# Altium schematic sheet ChargeControlBoard.SchDoc
size A3
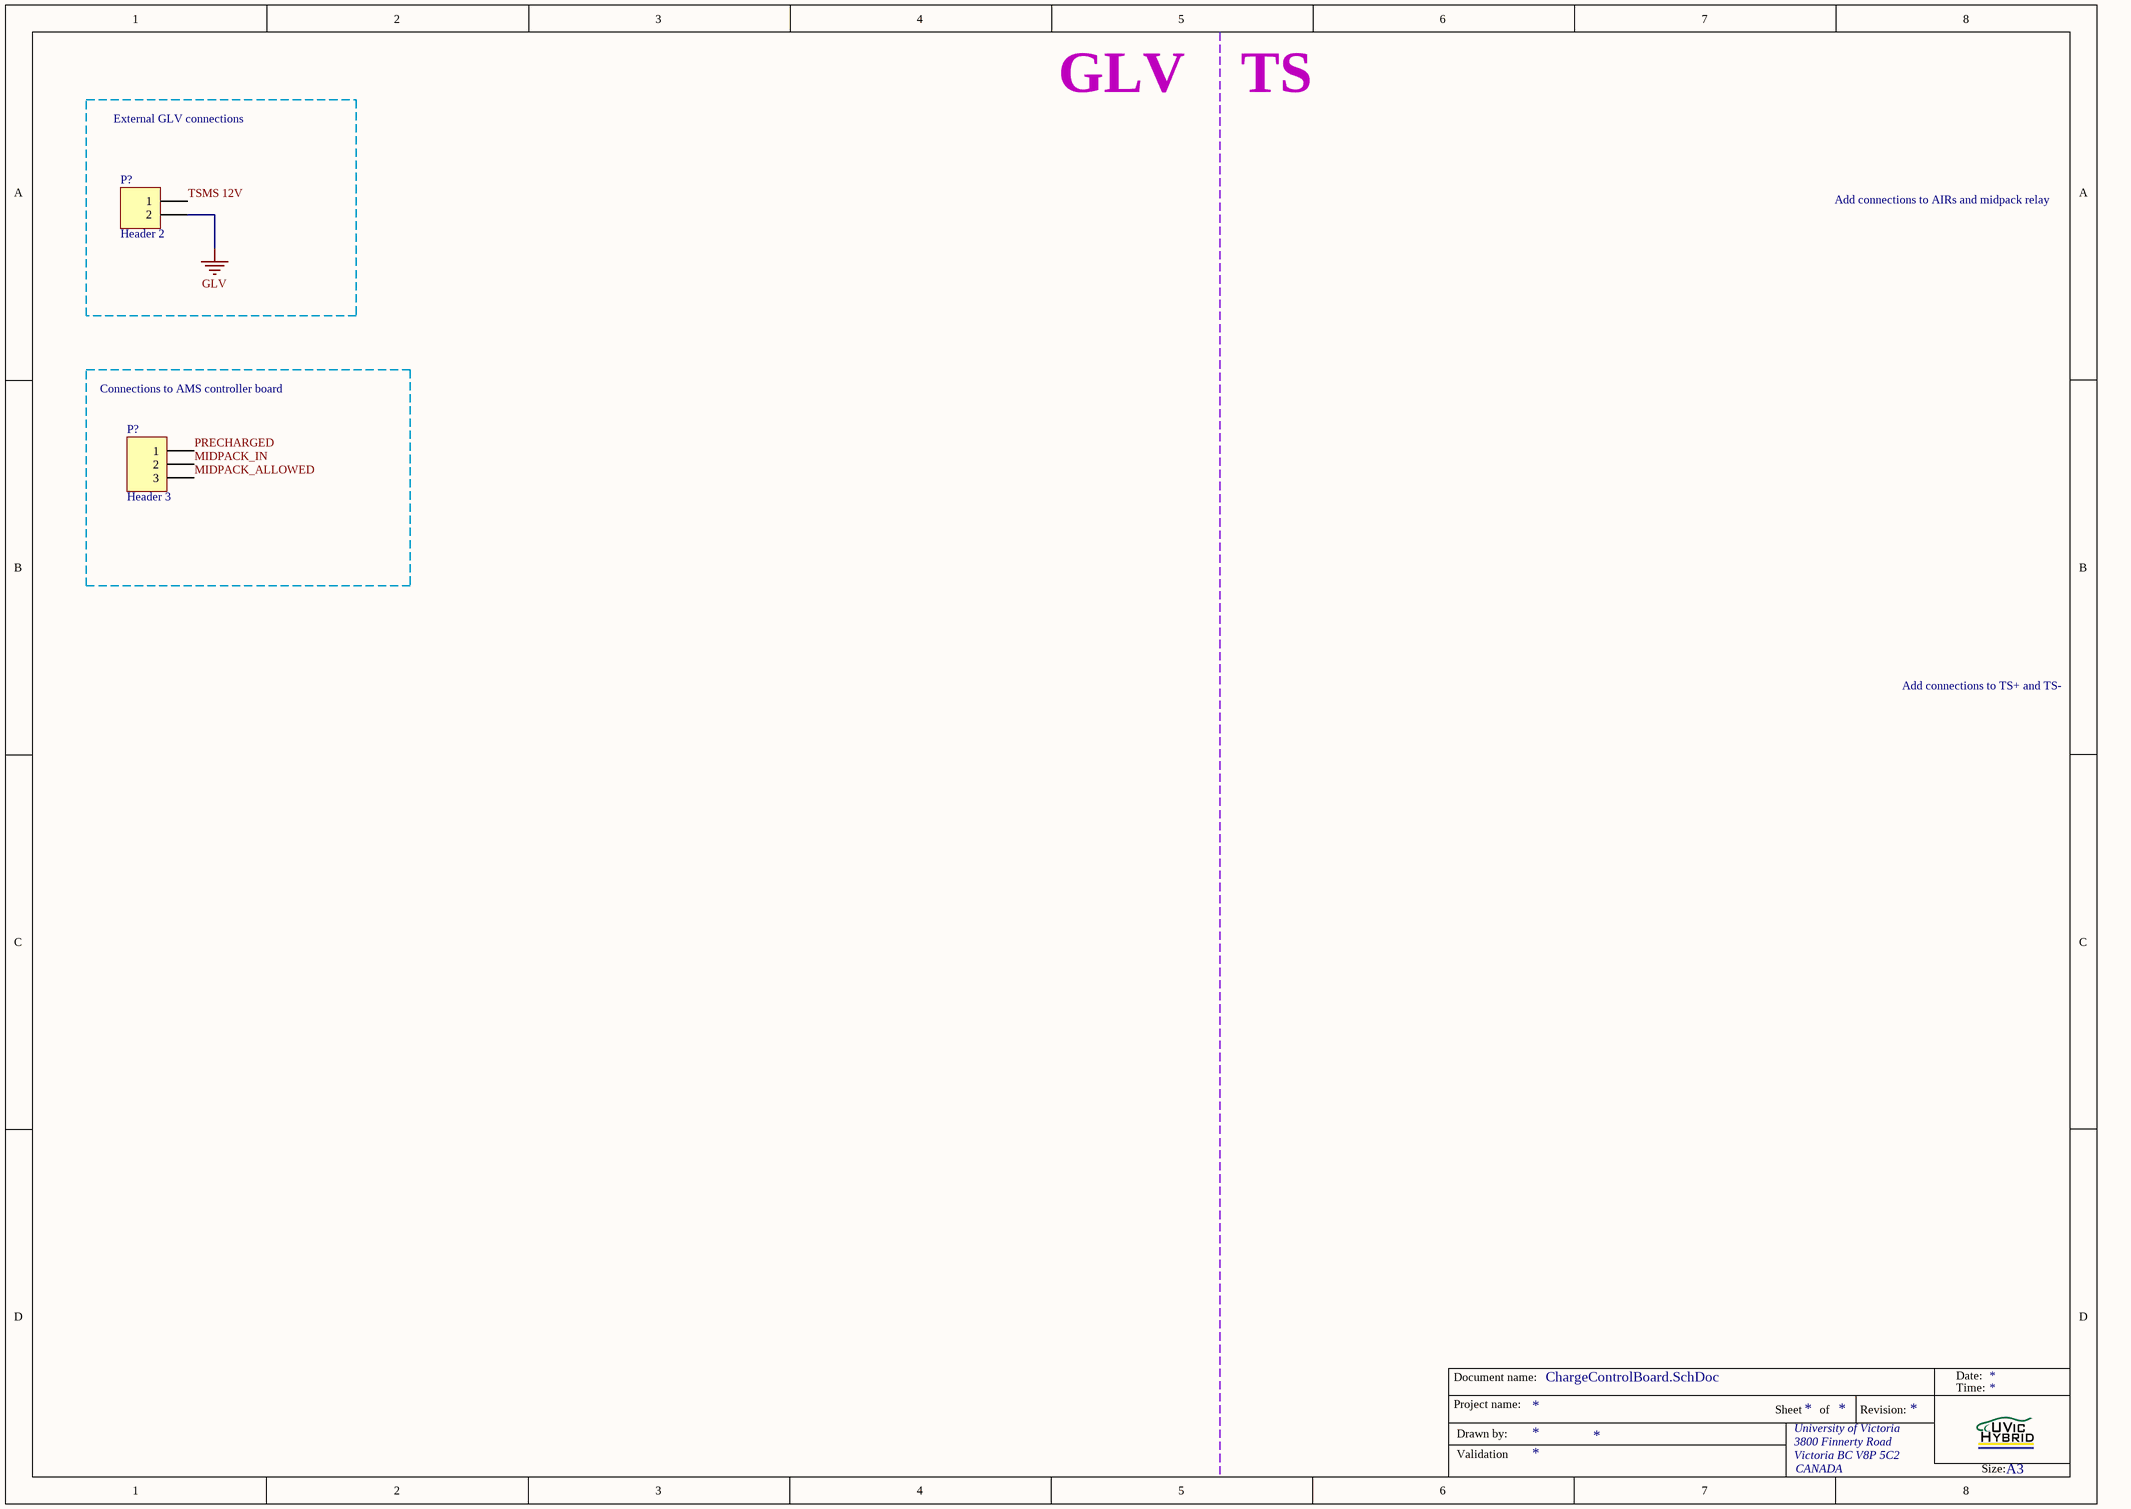
[diagram p0: ChargeControlBoard.SchDoc]

## Parts
(Parts that share a designator on the sheet are numbered #1, #2 ... from top to bottom, then left to right.)
P?#1  Header 2  [2 Pin Nanofit]
P?#2  Header 3  [3-pin Vertical nanofit]

## Blocks framed on the sheet
External GLV connections: P?#1
Connections to AMS controller board: P?#2

## Nets
GLV: P?#1.2
MIDPACK_ALLOWED: P?#2.3
MIDPACK_IN: P?#2.2
PRECHARGED: P?#2.1
TSMS 12V: P?#1.1

## Notes on the sheet
- GLV
- TS
- Add connections to AIRs and midpack relay
- Add connections to TS+ and TS-
- Document name:
- Date:
- Time:
- Project name:
- Drawn by:
- Validation
- Sheet
- University of Victoria
- 3800 Finnerty Road
- Victoria BC V8P 5C2
- of
- Revision:
- CANADA
- Size:
- A3

## Library data of the parts
P?#1 = Header 2: Header, 2-Pin; LatestRevisionDate: 17-Jul-2002; LatestRevisionNote: Re-released for DXP Platform.; Publisher: Altium Limited
P?#2 = Header 3: Header, 3-Pin; LatestRevisionDate: 17-Jul-2002; LatestRevisionNote: Re-released for DXP Platform.; Publisher: Altium Limited